# Altium schematic sheet Sheet1.SchDoc
size A; SheetNumber: 1; SheetTotal: 1
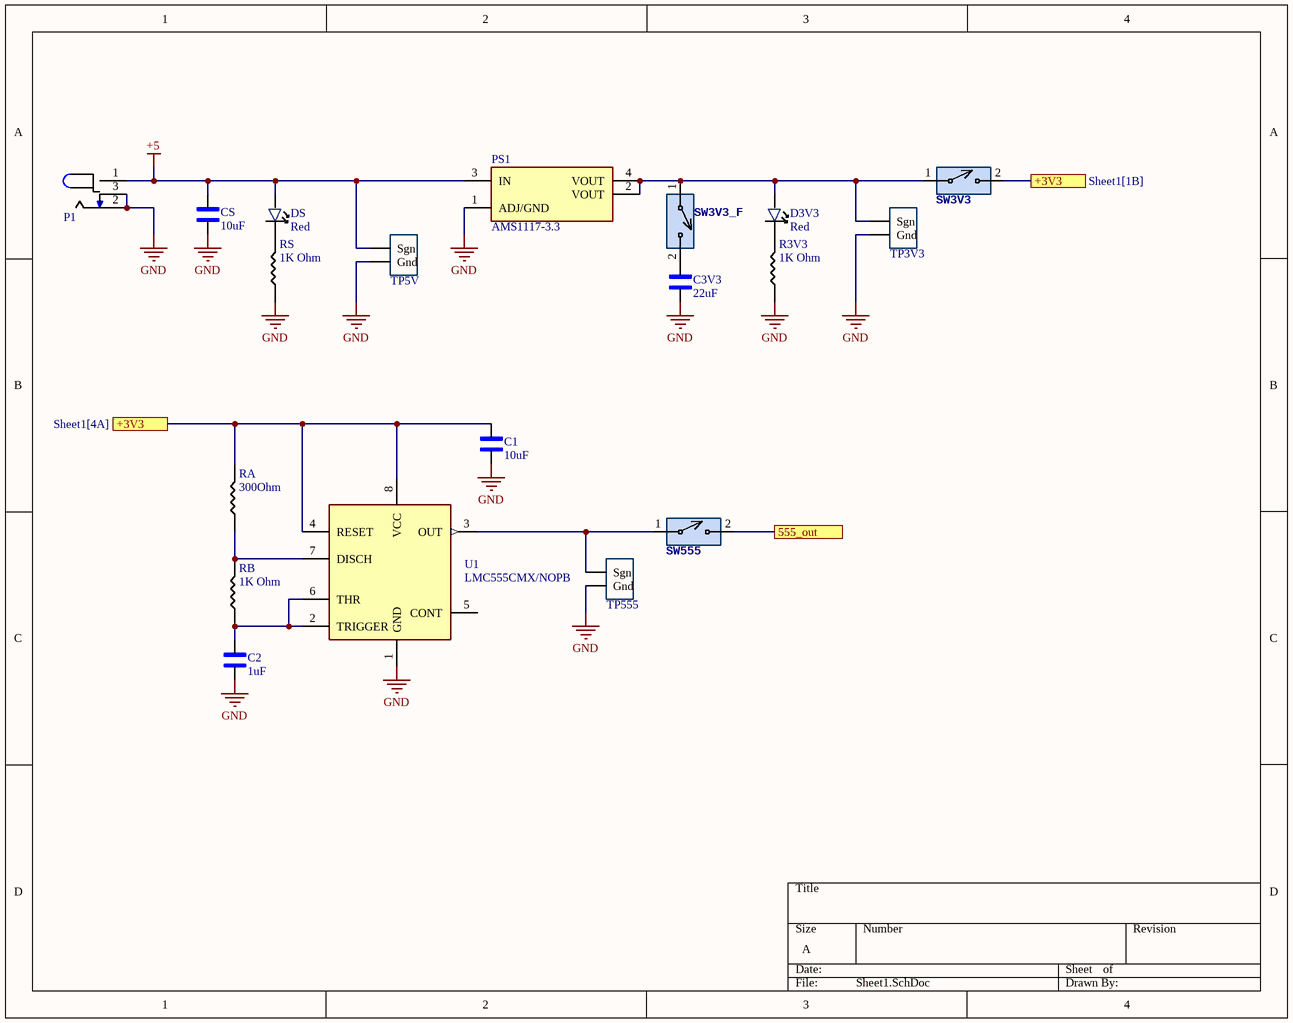
[diagram p0: Sheet1.SchDoc]

## Parts
C1  10uF  [1206_Passive_Capacitor]
C2  1uF  [1206_Passive_Capacitor]
C3V3  22uF  [1206_Passive_Capacitor]
CS  10uF  [1206_Passive_Capacitor]
D3V3  Red  [LED_1206]
DS  Red  [LED_1206]
P1  Power Jack  [Power_Jack]  (value not drawn)
PS1  AMS1117-3.3  [LDO]
R3V3  value 1K Ohm  [1206_Passive_Resitor]  (hidden comment: 1k)
RA  value 300Ohm  [1206_Passive_Resitor]  (hidden comment: 300 Ohm)
RB  value 1K Ohm  [1206_Passive_Resitor]  (hidden comment: 1k)
RS  value 1K Ohm  [1206_Passive_Resitor]  (hidden comment: 1k)
SW3V3  SW_2Pin_100mil_Switch  [2Pin-Header-Conn]  (value not drawn)
SW3V3_F  SW_2Pin_100mil_Switch  [2Pin-Header-Conn]  (value not drawn)
SW555  SW_2Pin_100mil_Switch  [2Pin-Header-Conn]  (value not drawn)
TP3V3  10x Probe TP  [TP10x_Probe]  (value not drawn)
TP5V  10x Probe TP  [TP10x_Probe]  (value not drawn)
TP555  10x Probe TP  [TP10x_Probe]  (value not drawn)
U1  LMC555CMX/NOPB  [TS555IDTTR]

## Ports
555_out, +3V3 (see Sheet1[1B]), +3V3 (see Sheet1[4A])

## Nets
+5: CS.2 DS.1 P1.1 PS1.3(IN) TP5V.1(Sgn)
GND: C1.1 C2.1 C3V3.1 CS.1 P1.2 P1.3 PS1.1(ADJ/GND) R3V3.1 RS.1 TP3V3.2(Gnd) TP5V.2(Gnd) TP555.2(Gnd) U1.1(GND)
555_out: SW555.2 ; port 555_out
+3V3: C1.2 RA.2 SW3V3.2 U1.4(RESET) U1.8(VCC) ; port +3V3
NetC2_2: C2.2 RB.1 U1.2(TRIGGER) U1.6(THR)
NetC3V3_2: C3V3.2 SW3V3_F.2
NetD3V3_1: D3V3.1 PS1.2(VOUT) PS1.4(VOUT) SW3V3.1 SW3V3_F.1 TP3V3.1(Sgn)
NetD3V3_2: D3V3.2 R3V3.2
NetDS_2: DS.2 RS.2
NetRA_1: RA.1 RB.2 U1.7(DISCH)
NetSW555_1: SW555.1 TP555.1(Sgn) U1.3(OUT)

Not connected (* = marked no-connect by the designer): U1 5(CONT)

## Library data of the parts
C1 = C_10uF_1206: 10uF ±10% 50V X5R 1206 Multilayer Ceramic Capacitors MLCC - SMD/SMT RoHS; MFR Part #: CL31A106KBHNNNE; Type: Basic; LCSC Part#: C13585; Datasheet: https://datasheet.lcsc.com/lcsc/1810221112_Samsung-Electro-Mechanics-CL31A106KBHNNNE_C13585.pdf; Value: 10uF
C2 = C_1uF_1206: MULTILAYER CERAMIC CAPACITORS MLCC - SMD/SMT 1UF 50V 1206 ROHS; MFR Part #: CL31B105KBHNNNE; Type: Basic; Digikey Link: https://www.digikey.com/product-detail/en/C1206C105M4RACTU/399-8150-1-ND/3471873/?itemSeq=304982366; LCSC Part#: C1848; Value: 1uF
C3V3 = C_22uF_1206: 22uF ±10% 25V X5R 1206 Multilayer Ceramic Capacitors MLCC - SMD/SMT RoHS; MFR Part #: CL31A226KAHNNNE; Type: basic; LCSC Part#: C12891; Datasheet: https://datasheet.lcsc.com/lcsc/1811031514_Samsung-Electro-Mechanics-CL31A226KAHNNNE_C12891.pdf; Value: 22uF
CS = C_10uF_1206: 10uF ±10% 50V X5R 1206 Multilayer Ceramic Capacitors MLCC - SMD/SMT RoHS; MFR Part #: CL31A106KBHNNNE; LCSC Part#: C13585; Datasheet: https://datasheet.lcsc.com/lcsc/1810221112_Samsung-Electro-Mechanics-CL31A106KBHNNNE_C13585.pdf; Type: Basic; Value: 10uF
D3V3 = LED_RED_1206: Red 621~631nm 1206 Light Emitting Diodes (LED) RoHS; MFR Part #: 15-21/R6C-FQ1R1B/2T; Type: Extended; LCSC Part#: C93133; Datasheet: https://datasheet.lcsc.com/szlcsc/1811151241_Everlight-Elec-15-21-R6C-FQ1R1B-2T_C93133.pdf; Value: Red
DS = LED_RED_1206: Red 621~631nm 1206 Light Emitting Diodes (LED) RoHS; MFR Part #: 15-21/R6C-FQ1R1B/2T; LCSC Part#: C93133; Type: Extended; Datasheet: https://datasheet.lcsc.com/szlcsc/1811151241_Everlight-Elec-15-21-R6C-FQ1R1B-2T_C93133.pdf; Value: Red
P1 = P_Power Jack: Power Barrel Connector Jack 2.10mm ID (0.083"), 5.50mm OD (0.217") Through Hole, Right Angle; MFR Part #: PJ-102A; Value: CONN PWR JACK 2X5.5MM SOLDER; Digikey Link: https://www.digikey.com/product-detail/en/PJ-102A/CP-102A-ND/275425/?itemSeq=304982367; LCSC Part#: C136744; Type: Extended
PS1 = PS_AMS_LDO_3v3: LOW DROPOUT REGULATORS(LDO) POSITIVE FIXED 1.3V @ 800MA 15V 3.3V 1A SOT-223 ROHS; Value: IC REG LINEAR 3.3V 800MA SOT223; MFR Part #: AMS1117-3.3; LCSC Part#: C6186; Type: Basic
R3V3 RB RS = R_1K_1206: CHIP RESISTOR - SURFACE MOUNT 1KOHMS ±1% 1/4W 1206 ROHS; MFR Part #: RNCP1206FTD1K00CT; Digikey Link: https://www.digikey.com/product-detail/en/RNCP1206FTD1K00/RNCP1206FTD1K00CT-ND/2240675/?itemSeq=304982373; LCSC Part#: C4410; Type: Basic
RA = R_300Ohm_1206: CHIP RESISTOR - SURFACE MOUNT 300OHMS ±1% 1/4W 1206 ROHS; MFR Part #: 1206W4F3000T5E; Datasheet: https://datasheet.lcsc.com/szlcsc/Uniroyal-Elec-1206W4F3000T5E_C17887.pdf; LCSC Part#: C17887; Type: Basic
SW3V3 SW3V3_F SW555 = SW_2Pin_100mil_Switch: 2Pin Header; LCSC Part#: C124375; Type: Extended
TP3V3 TP5V TP555 = TP_10x_Probe: Test Point 300 mil centers
U1 = U_555_Fast: 555 Type, Timer/Oscillator _Single_ IC 3MHz 8-SO; Package: SOIC-8; MFR Part #: LMC555CMX/NOPB; DigiKey link: https://www.digikey.com/product-detail/en/texas-instruments/LMC555CMX-NOPB/LMC555CMX-NOPBCT-ND/1010550; LCSC Part#: C90760; Type: Extended